# Altium schematic sheet PP5_Boot.SchDoc
size 149 x 100 mm
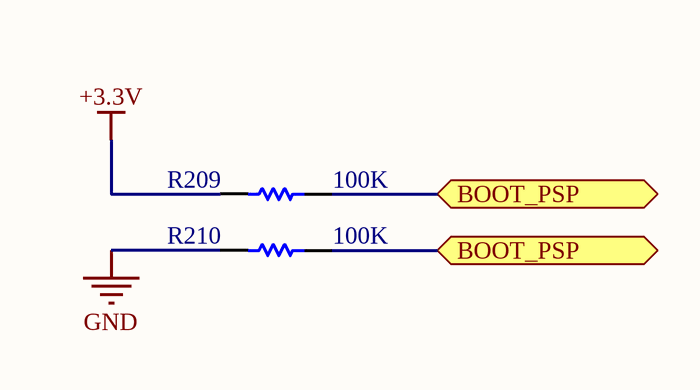
[diagram p0: PP5_Boot.SchDoc]

## Parts
R209  value 100K  [AXIAL-0.3]  (hidden comment: Res1)
R210  value 100K  [AXIAL-0.3]  (hidden comment: Res1)

## Ports
BOOT_PSP

## Nets
+3.3V: R209.2
GND: R210.2
BOOT_PSP: R209.1 R210.1 ; port BOOT_PSP

## Library data of the parts
R209 R210 = Res1: Resistor